# EAGLE design obc_PQ60 (EAGLE 7.3.0)
OBC with integrated microcontroller
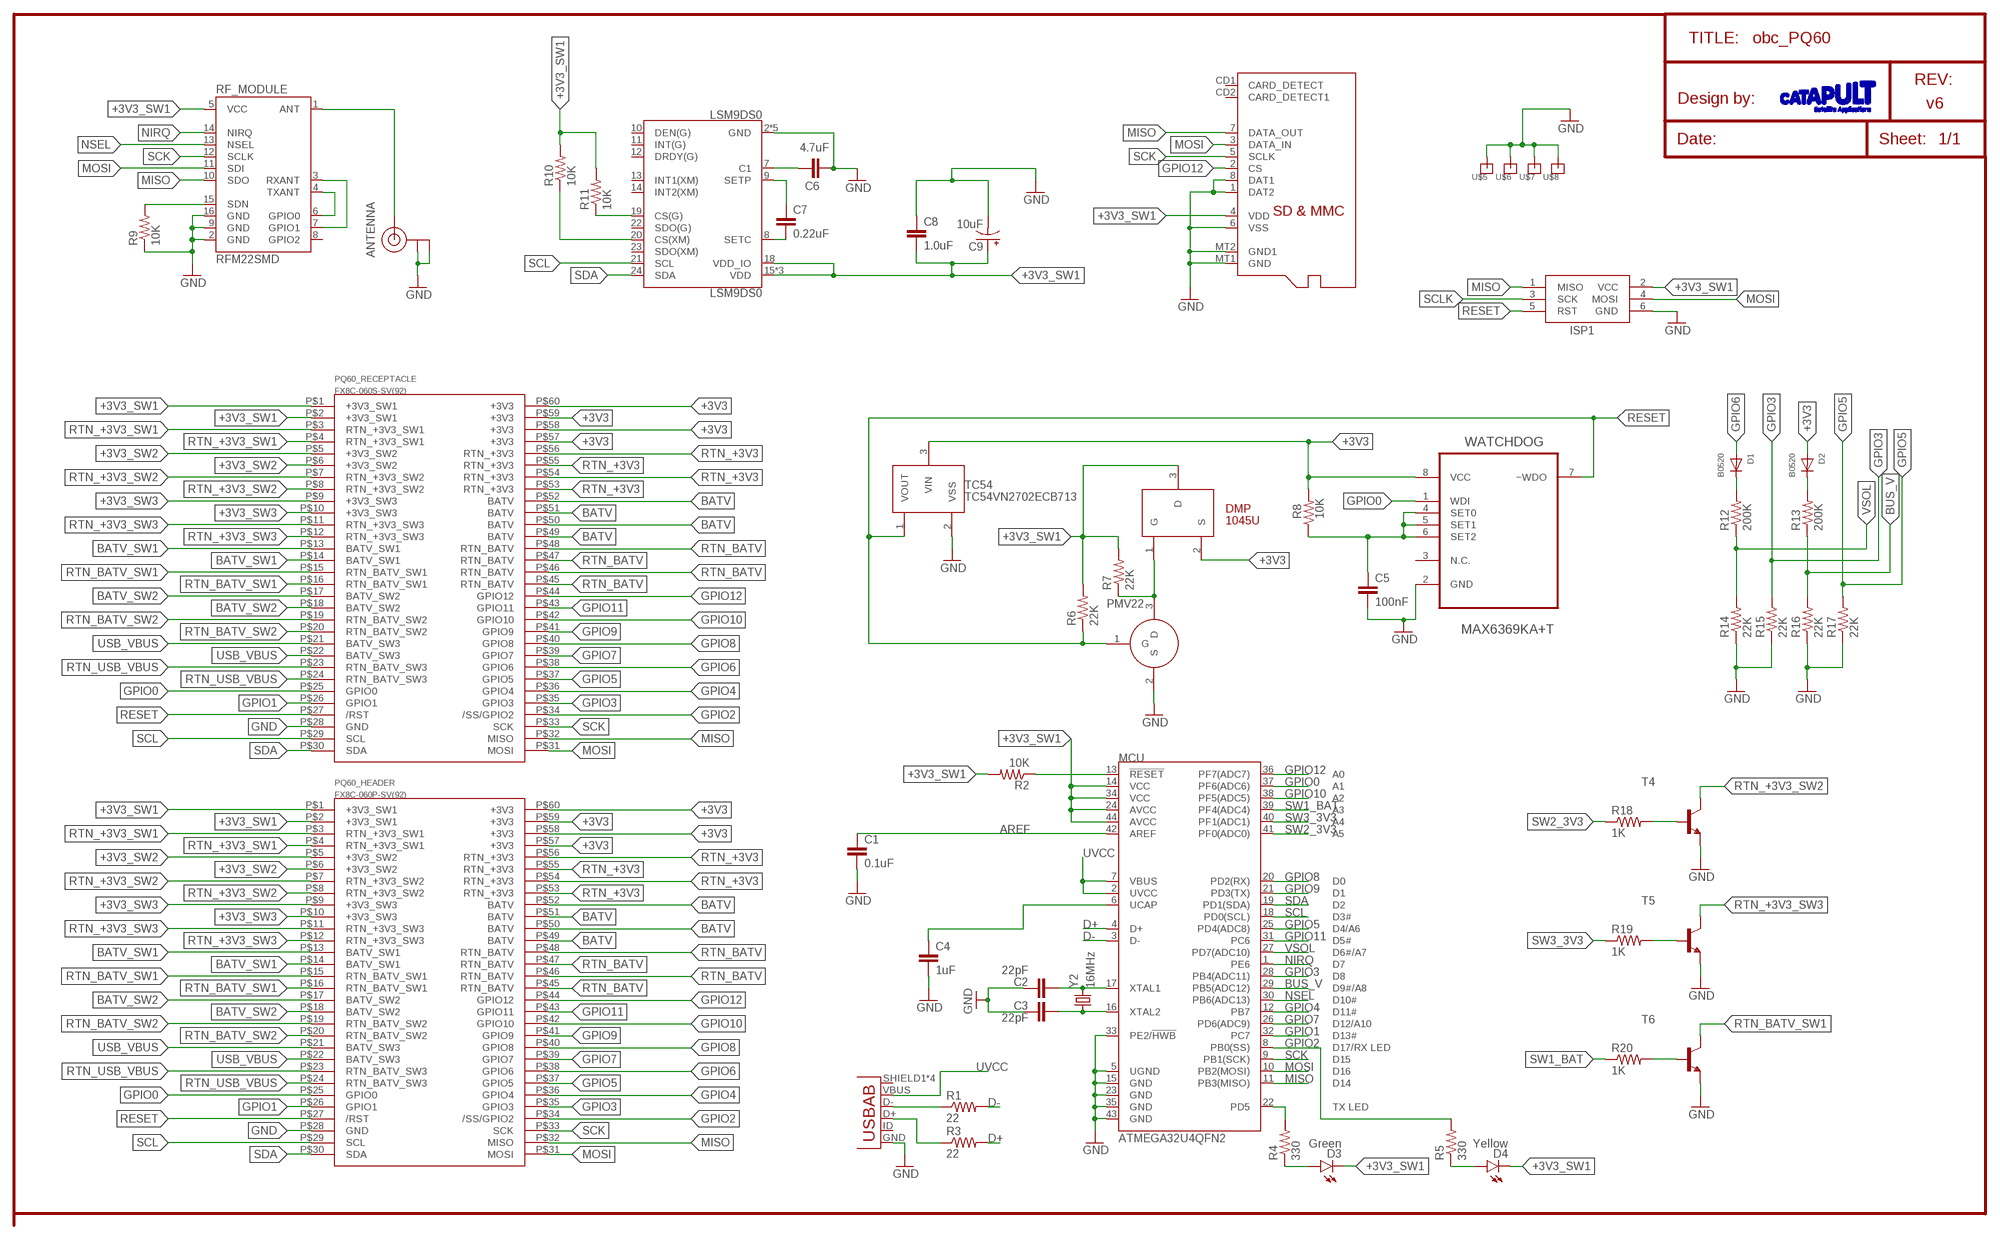
[diagram p0: schematic, sheet 1]

## Parts
ANTENNA  U.FL  [U.FL]
C1  0.1uF  CAP0603-CAP  [0603-CAP]
C2  22pF  CAP0603-CAP  [0603-CAP]
C3  22pF  CAP0603-CAP  [0603-CAP]
C4  1uF  CAP0603-CAP  [0603-CAP]
C5  100nF  CAP0402-CAP  [0402-CAP]
C6  4.7uF  CAP0402-CAP  [0402-CAP]
C7  0.22uF  CAP0402-CAP  [0402-CAP]
C8  1.0uF  CAP0402-CAP  [0402-CAP]
C9  10uF  CAP_POL1206  [EIA3216]
D1  B0520  DIODESOD-123  [SOD-123]
D2  B0520  DIODESOD-123  [SOD-123]
D3  Green  LED0603  [LED-0603]
D4  Yellow  LED0603  [LED-0603]
DMP  1045U  DMP1045USMD  [SOT-23_DMP]
ISP1  AVRISP-6  [AVRISP]
JP1  USB-AB  [USB-AB-MICRO-SMD]
LSM9DS0  LSM9DS0  [LGA-24]
MCU  ATMEGA32U4QFN2  [QFN-44-NOPAD]
PMV22  PMV22SMD  [SOT-23]
PQ60_HEADER  FX8C-060P-SV(92)  [FX8C-060P-SV(92)]
PQ60_RECEPTACLE  FX8C-060S-SV(92)  [FX8C-060S-SV(92)]
R1  22  RESISTOR0603-RES  [0603-RES]
R2  10K  RESISTOR0603-RES  [0603-RES]
R3  22  RESISTOR0603-RES  [0603-RES]
R4  330  RESISTOR0603-RES  [0603-RES]
R5  330  RESISTOR0603-RES  [0603-RES]
R6  22K  RESISTOR0402-RES  [0402-RES]
R7  22K  RESISTOR0402-RES  [0402-RES]
R8  10K  RESISTOR0402-RES  [0402-RES]
R9  10K  RESISTOR0402-RES  [0402-RES]
R10  10K  RESISTOR0402-RES  [0402-RES]
R11  10K  RESISTOR0402-RES  [0402-RES]
R12  200K  RESISTOR0402-RES  [0402-RES]
R13  200K  RESISTOR0402-RES  [0402-RES]
R14  22K  RESISTOR0402-RES  [0402-RES]
R15  22K  RESISTOR0402-RES  [0402-RES]
R16  22K  RESISTOR0402-RES  [0402-RES]
R17  22K  RESISTOR0402-RES  [0402-RES]
R18  1K  RESISTOR0402-RES  [0402-RES]
R19  1K  RESISTOR0402-RES  [0402-RES]
R20  1K  RESISTOR0402-RES  [0402-RES]
RF_MODULE  RFM22SMD  [RFM22-XXX-S2]
SD  MICROSD  [MICROSD]
T4  BC817-16-NPN-SOT23-BEC  [SOT23-BEC]
T5  BC817-16-NPN-SOT23-BEC  [SOT23-BEC]
T6  BC817-16-NPN-SOT23-BEC  [SOT23-BEC]
TC54  TC54VN2702ECB713  [SOT-23A]
U$5  3MMPILAR  [3MMPILAR]
U$6  3MMPILAR  [3MMPILAR]
U$7  3MMPILAR  [3MMPILAR]
U$8  3MMPILAR  [3MMPILAR]
WATCHDOG  MAX6369KA+T  [SOT65P280X145-8N]
Y2  16MHz  CRYSTAL5X3  [CRYSTAL-SMD-5X3]

## Nets
+3V3: D2.A DMP.2(S) PQ60_HEADER.P$57(+3V3) PQ60_HEADER.P$58(+3V3) PQ60_HEADER.P$59(+3V3) PQ60_HEADER.P$60(+3V3) PQ60_RECEPTACLE.P$57(+3V3) PQ60_RECEPTACLE.P$58(+3V3) PQ60_RECEPTACLE.P$59(+3V3) PQ60_RECEPTACLE.P$60(+3V3) R8.2 TC54.3(VIN) WATCHDOG.8(VCC)
+3V3_SW1: C8.2 C9.A(+) D3.C D4.C DMP.3(D) ISP1.2(VCC) LSM9DS0.15(VDD) LSM9DS0.16(VDD) LSM9DS0.17(VDD) LSM9DS0.18(VDD_IO) MCU.14(VCC) MCU.24(AVCC) MCU.34(VCC) MCU.44(AVCC) PQ60_HEADER.P$1(+3V3_SW1) PQ60_HEADER.P$2(+3V3_SW1) PQ60_RECEPTACLE.P$1(+3V3_SW1) PQ60_RECEPTACLE.P$2(+3V3_SW1) R2.2 R6.2 R7.2 R10.2 R11.2 RF_MODULE.5(VCC) SD.4(VDD)
+3V3_SW2: PQ60_HEADER.P$5(+3V3_SW2) PQ60_HEADER.P$6(+3V3_SW2) PQ60_RECEPTACLE.P$5(+3V3_SW2) PQ60_RECEPTACLE.P$6(+3V3_SW2)
+3V3_SW3: PQ60_HEADER.P$9(+3V3_SW3) PQ60_HEADER.P$10(+3V3_SW3) PQ60_RECEPTACLE.P$9(+3V3_SW3) PQ60_RECEPTACLE.P$10(+3V3_SW3)
AREF: C1.1 MCU.42(AREF)
BATV: PQ60_HEADER.P$49(BATV) PQ60_HEADER.P$50(BATV) PQ60_HEADER.P$51(BATV) PQ60_HEADER.P$52(BATV) PQ60_RECEPTACLE.P$49(BATV) PQ60_RECEPTACLE.P$50(BATV) PQ60_RECEPTACLE.P$51(BATV) PQ60_RECEPTACLE.P$52(BATV)
BATV_SW1: PQ60_HEADER.P$13(BATV_SW1) PQ60_HEADER.P$14(BATV_SW1) PQ60_RECEPTACLE.P$13(BATV_SW1) PQ60_RECEPTACLE.P$14(BATV_SW1)
BATV_SW2: PQ60_HEADER.P$17(BATV_SW2) PQ60_HEADER.P$18(BATV_SW2) PQ60_RECEPTACLE.P$17(BATV_SW2) PQ60_RECEPTACLE.P$18(BATV_SW2)
BUS_V: MCU.29(PB5(ADC12)) R13.1 R16.2
D+: MCU.4(D+) R3.2
D-: MCU.3(D-) R1.2
GND: ANTENNA.P$1(GND) ANTENNA.P$2(GND) C1.2 C2.1 C3.1 C4.2 C5.2 C6.1 C8.1 C9.C(-) ISP1.6(GND) JP1.GND LSM9DS0.2(GND) LSM9DS0.3(GND) LSM9DS0.4(GND) LSM9DS0.5(GND) LSM9DS0.6(GND) MCU.5(UGND) MCU.15(GND) MCU.23(GND) MCU.33(PE2/!HWB) MCU.35(GND) MCU.43(GND) PMV22.2(S) PQ60_HEADER.P$28(GND) PQ60_RECEPTACLE.P$28(GND) R9.1 R14.1 R15.1 R16.1 R17.1 RF_MODULE.2(GND) RF_MODULE.9(GND) RF_MODULE.16(GND) SD.1(DAT2) SD.6(VSS) SD.8(DAT1) SD.MT1(GND) SD.MT2(GND1) T4.E T5.E T6.E TC54.2(VSS) U$5.P$1 U$6.P$1 U$7.P$1 U$8.P$1 WATCHDOG.2(GND)
GPIO0: MCU.37(PF6(ADC6)) PQ60_HEADER.P$25(GPIO0) PQ60_RECEPTACLE.P$25(GPIO0) WATCHDOG.1(WDI)
GPIO1: MCU.32(PC7) PQ60_HEADER.P$26(GPIO1) PQ60_RECEPTACLE.P$26(GPIO1)
GPIO2: MCU.8(PB0(SS)) PQ60_HEADER.P$34(/SS/GPIO2) PQ60_RECEPTACLE.P$34(/SS/GPIO2) R5.2
GPIO3: MCU.28(PB4(ADC11)) PQ60_HEADER.P$35(GPIO3) PQ60_RECEPTACLE.P$35(GPIO3) R15.2
GPIO4: MCU.12(PB7) PQ60_HEADER.P$36(GPIO4) PQ60_RECEPTACLE.P$36(GPIO4)
GPIO5: MCU.25(PD4(ADC8)) PQ60_HEADER.P$37(GPIO5) PQ60_RECEPTACLE.P$37(GPIO5) R17.2
GPIO6: D1.A PQ60_HEADER.P$38(GPIO6) PQ60_RECEPTACLE.P$38(GPIO6)
GPIO7: MCU.26(PD6(ADC9)) PQ60_HEADER.P$39(GPIO7) PQ60_RECEPTACLE.P$39(GPIO7)
GPIO8: MCU.20(PD2(RX)) PQ60_HEADER.P$40(GPIO8) PQ60_RECEPTACLE.P$40(GPIO8)
GPIO9: MCU.21(PD3(TX)) PQ60_HEADER.P$41(GPIO9) PQ60_RECEPTACLE.P$41(GPIO9)
GPIO10: MCU.38(PF5(ADC5)) PQ60_HEADER.P$42(GPIO10) PQ60_RECEPTACLE.P$42(GPIO10)
GPIO11: MCU.31(PC6) PQ60_HEADER.P$43(GPIO11) PQ60_RECEPTACLE.P$43(GPIO11)
GPIO12: MCU.36(PF7(ADC7)) PQ60_HEADER.P$44(GPIO12) PQ60_RECEPTACLE.P$44(GPIO12) SD.2(CS)
MISO: ISP1.1(MISO) MCU.11(PB3(MISO)) PQ60_HEADER.P$32(MISO) PQ60_RECEPTACLE.P$32(MISO) RF_MODULE.10(SDO) SD.7(DATA_OUT)
MOSI: ISP1.4(MOSI) MCU.10(PB2(MOSI)) PQ60_HEADER.P$31(MOSI) PQ60_RECEPTACLE.P$31(MOSI) RF_MODULE.11(SDI) SD.3(DATA_IN)
N$1: MCU.13(!RESET) R2.1
N$2: C4.1 MCU.6(UCAP)
N$3: C3.2 MCU.16(XTAL2) Y2.1
N$4: C2.2 MCU.17(XTAL1) Y2.3
N$5: JP1.D+ R3.1
N$6: JP1.D- R1.1
N$7: MCU.22(PD5) R4.2
N$8: DMP.1(G) PMV22.3(D) R7.1
N$9: D4.A R5.1
N$10: D3.A R4.1
N$11: C5.1 R8.1 WATCHDOG.4(SET0) WATCHDOG.5(SET1) WATCHDOG.6(SET2)
N$12: RF_MODULE.4(TXANT) RF_MODULE.6(GPIO0)
N$13: RF_MODULE.3(RXANT) RF_MODULE.7(GPIO1)
N$14: ANTENNA.P$3(SIGNAL) RF_MODULE.1(ANT)
N$15: C6.2 LSM9DS0.7(C1)
N$16: R9.2 RF_MODULE.15(SDN)
N$17: D1.C R12.2
N$18: LSM9DS0.19(CS(G)) R11.1
N$19: LSM9DS0.20(CS(XM)) R10.1
N$20: C7.1 LSM9DS0.9(SETP)
N$21: C7.2 LSM9DS0.8(SETC)
N$22: R18.2 T4.B
N$23: R19.2 T5.B
N$24: R20.2 T6.B
N$26: D2.C R13.2
NIRQ: MCU.1(PE6) RF_MODULE.14(NIRQ)
NSEL: MCU.30(PB6(ADC13)) RF_MODULE.13(NSEL)
RESET: ISP1.5(RST) PMV22.1(G) PQ60_HEADER.P$27(/RST) PQ60_RECEPTACLE.P$27(/RST) R6.1 TC54.1(VOUT) WATCHDOG.7(~WDO)
RTN_+3V3: PQ60_HEADER.P$53(RTN_+3V3) PQ60_HEADER.P$54(RTN_+3V3) PQ60_HEADER.P$55(RTN_+3V3) PQ60_HEADER.P$56(RTN_+3V3) PQ60_RECEPTACLE.P$53(RTN_+3V3) PQ60_RECEPTACLE.P$54(RTN_+3V3) PQ60_RECEPTACLE.P$55(RTN_+3V3) PQ60_RECEPTACLE.P$56(RTN_+3V3)
RTN_+3V3_SW1: PQ60_HEADER.P$3(RTN_+3V3_SW1) PQ60_HEADER.P$4(RTN_+3V3_SW1) PQ60_RECEPTACLE.P$3(RTN_+3V3_SW1) PQ60_RECEPTACLE.P$4(RTN_+3V3_SW1)
RTN_+3V3_SW2: PQ60_HEADER.P$7(RTN_+3V3_SW2) PQ60_HEADER.P$8(RTN_+3V3_SW2) PQ60_RECEPTACLE.P$7(RTN_+3V3_SW2) PQ60_RECEPTACLE.P$8(RTN_+3V3_SW2) T4.C
RTN_+3V3_SW3: PQ60_HEADER.P$11(RTN_+3V3_SW3) PQ60_HEADER.P$12(RTN_+3V3_SW3) PQ60_RECEPTACLE.P$11(RTN_+3V3_SW3) PQ60_RECEPTACLE.P$12(RTN_+3V3_SW3) T5.C
RTN_BATV: PQ60_HEADER.P$45(RTN_BATV) PQ60_HEADER.P$46(RTN_BATV) PQ60_HEADER.P$47(RTN_BATV) PQ60_HEADER.P$48(RTN_BATV) PQ60_RECEPTACLE.P$45(RTN_BATV) PQ60_RECEPTACLE.P$46(RTN_BATV) PQ60_RECEPTACLE.P$47(RTN_BATV) PQ60_RECEPTACLE.P$48(RTN_BATV)
RTN_BATV_SW1: PQ60_HEADER.P$15(RTN_BATV_SW1) PQ60_HEADER.P$16(RTN_BATV_SW1) PQ60_RECEPTACLE.P$15(RTN_BATV_SW1) PQ60_RECEPTACLE.P$16(RTN_BATV_SW1) T6.C
RTN_BATV_SW2: PQ60_HEADER.P$19(RTN_BATV_SW2) PQ60_HEADER.P$20(RTN_BATV_SW2) PQ60_RECEPTACLE.P$19(RTN_BATV_SW2) PQ60_RECEPTACLE.P$20(RTN_BATV_SW2)
RTN_USB_VBUS: PQ60_HEADER.P$23(RTN_BATV_SW3) PQ60_HEADER.P$24(RTN_BATV_SW3) PQ60_RECEPTACLE.P$23(RTN_BATV_SW3) PQ60_RECEPTACLE.P$24(RTN_BATV_SW3)
SCK: MCU.9(PB1(SCK)) PQ60_HEADER.P$33(SCK) PQ60_RECEPTACLE.P$33(SCK) RF_MODULE.12(SCLK) SD.5(SCLK)
SCL: LSM9DS0.21(SCL) MCU.18(PD0(SCL)) PQ60_HEADER.P$29(SCL) PQ60_RECEPTACLE.P$29(SCL)
SCLK: ISP1.3(SCK)
SDA: LSM9DS0.24(SDA) MCU.19(PD1(SDA)) PQ60_HEADER.P$30(SDA) PQ60_RECEPTACLE.P$30(SDA)
SW1_BAT: MCU.39(PF4(ADC4)) R20.1
SW2_3V3: MCU.41(PF0(ADC0)) R18.1
SW3_3V3: MCU.40(PF1(ADC1)) R19.1
USB_VBUS: PQ60_HEADER.P$21(BATV_SW3) PQ60_HEADER.P$22(BATV_SW3) PQ60_RECEPTACLE.P$21(BATV_SW3) PQ60_RECEPTACLE.P$22(BATV_SW3)
UVCC: JP1.VBUS MCU.2(UVCC) MCU.7(VBUS)
VSOL: MCU.27(PD7(ADC10)) R12.1 R14.2
Unconnected: JP1.ID(USBID) JP1.SHIELD1(SHIELD) JP1.SHIELD2(SHIELD) JP1.SHIELD3(SHIELD) JP1.SHIELD4(SHIELD) LSM9DS0.10(DEN(G)) LSM9DS0.11(INT(G)) LSM9DS0.12(DRDY(G)) LSM9DS0.13(INT1(XM)) LSM9DS0.14(INT2(XM)) LSM9DS0.22(SDO(G)) LSM9DS0.23(SDO(XM)) RF_MODULE.8(GPIO2) SD.CD1(CARD_DETECT) SD.CD2(CARD_DETECT1) WATCHDOG.3(N.C.)

## Notes on the sheet
- TITLE:
- REV:
- Design by:
- v6
- Date: | Sheet:

## Library data of the parts
ANTENNA = SparkFun-Connectors:U.FL: SMD antenna connector- WRL-09144; PROD_ID: CONN-09193
C1-C8 = SparkFun-Capacitors:CAP: Capacitor Standard 0603 ceramic capacitor, and 0.1" leaded capacitor.
C9 = SparkFun-Capacitors:CAP_POL: Capacitor Polarized These are standard SMD and PTH capacitors. Normally 10uF, 47uF, and 100uF in electrolytic and tantalum varieties. Always verify the external diameter of the through hole cap, it varies with capacity, voltage, and manufacturer. The EIA devices should be standard.
D1 D2 = adafruit:DIODE: Diode SMADIODE - SMA Surface Mount Package 20V 1A Schottky Diode Digikey: 641-1014-6-ND DO-1N4148 - Through Hole Small Current Diode SOD-123 20V 1 A (.5mV Vf) Schottky Diode - Digikey: MBRX120TPMSCT-ND SOD-323 10V 570mA (.38mV Vf, 3ns) Schottky Diode - Digikey: ZLLS410CT-ND SOD-523 30V 30mA Schottky Diode (RB751S-40TE61) - Digikey: RB751S-40TE61CT-ND SOT23-R/W - SOT23 Package (R = Solder Paste/Reflow Ovens, W = Hand-Soldering) BAT54Film 40V 300mA - Digikey: 497-7162-1-ND
D3 D4 = SparkFun-LED:LED: LEDs Standard schematic elements and footprints for 5mm, 3mm, 1206, and 0603 sized LEDs. 5mm - Spark Fun Electronics SKU : COM-00529 (and others)
DMP = OBC:DMP1045U: P-CHANNEL ENHANCEMENT MODE MOSFET
ISP1 = adafruit:AVRISP: AVR ISP HEADER Standard 6 pin header for AVR programming
JP1 = SparkFun-Connectors:USB-AB: This is a USB AB connector that is compatible with USB OTG. i.e. this connector can serve as a host or device
LSM9DS0 = SparkFun-DigitalIC:LSM9DS0: LSM9DS0 3D Accelerometer, 3D Gyroscope, 3D Magnetomter Features: 3 acceleration channels, 3 angular rate channels, 3 magnetic field channels ±2/±4/±6/±8/±16 g linear acceleration full scale ±2/±4/±8/±12 gauss magnetic full scale ±245/±500/±2000 dps angular rate full scale 16-bit data output SPI / I2C serial interfaces Analog supply voltage 2.4 V to 3.6 V Power-down mode / low-power mode Programmable interrupt generators Embedded self-test Embedded temperature sensor Embedded FIFO Position and motion detection functions Click/double-click recognition
MCU = SparkFun-DigitalIC:ATMEGA32U4: Atmel 44-pin 8-bit Microcontroller with 32KBytes of ISP Flash and USB Controller
PMV22 = OBC:PMV22
PQ60_HEADER = Template:FX8C-060P-SV(92)
PQ60_RECEPTACLE = Template:FX8C-060S-SV(92)
R1-R20 = SparkFun-Passives:RESISTOR: Resistor Basic schematic elements and footprints for 0603, 1206, and PTH resistors.
RF_MODULE = SparkFun-RF:RFM22: The RFM22 is a low-power, low cost radio that is capable of operating in the 434MHz and 900MHz open bands. It's frequency is software defined and there are some very good libraries written for it.
SD = adafruit:MICROSD: Micro-SD / Transflash card holder with SPI pinout For the 3M # 2908-05WB-MG and/or 4UCON #19656 push-push type
T4-T6 = transistor:*-NPN-: NPN Transistror BF959 corrected 2008.03.06
TC54 = OBC:TC54: VOLTAGE DETECTOR, 3.6UA, 10V, SMD-3
U$5-U$8 = LMA:3MMPILAR
WATCHDOG = Maxim_By_element14_Batch_1:MAX6369KA+T: Pin-Selectable Watchdog Timers; MPN: MAX6369KA+T; OC_FARNELL: 1787051; OC_NEWARK: 68K9450; PACKAGE: SOT23-8; SUPPLIER: Maxim
Y2 = SparkFun-FreqCtrl:CRYSTAL: Various standard crystals. Proven footprints.; PROD_ID: XTAL-08218

## Board
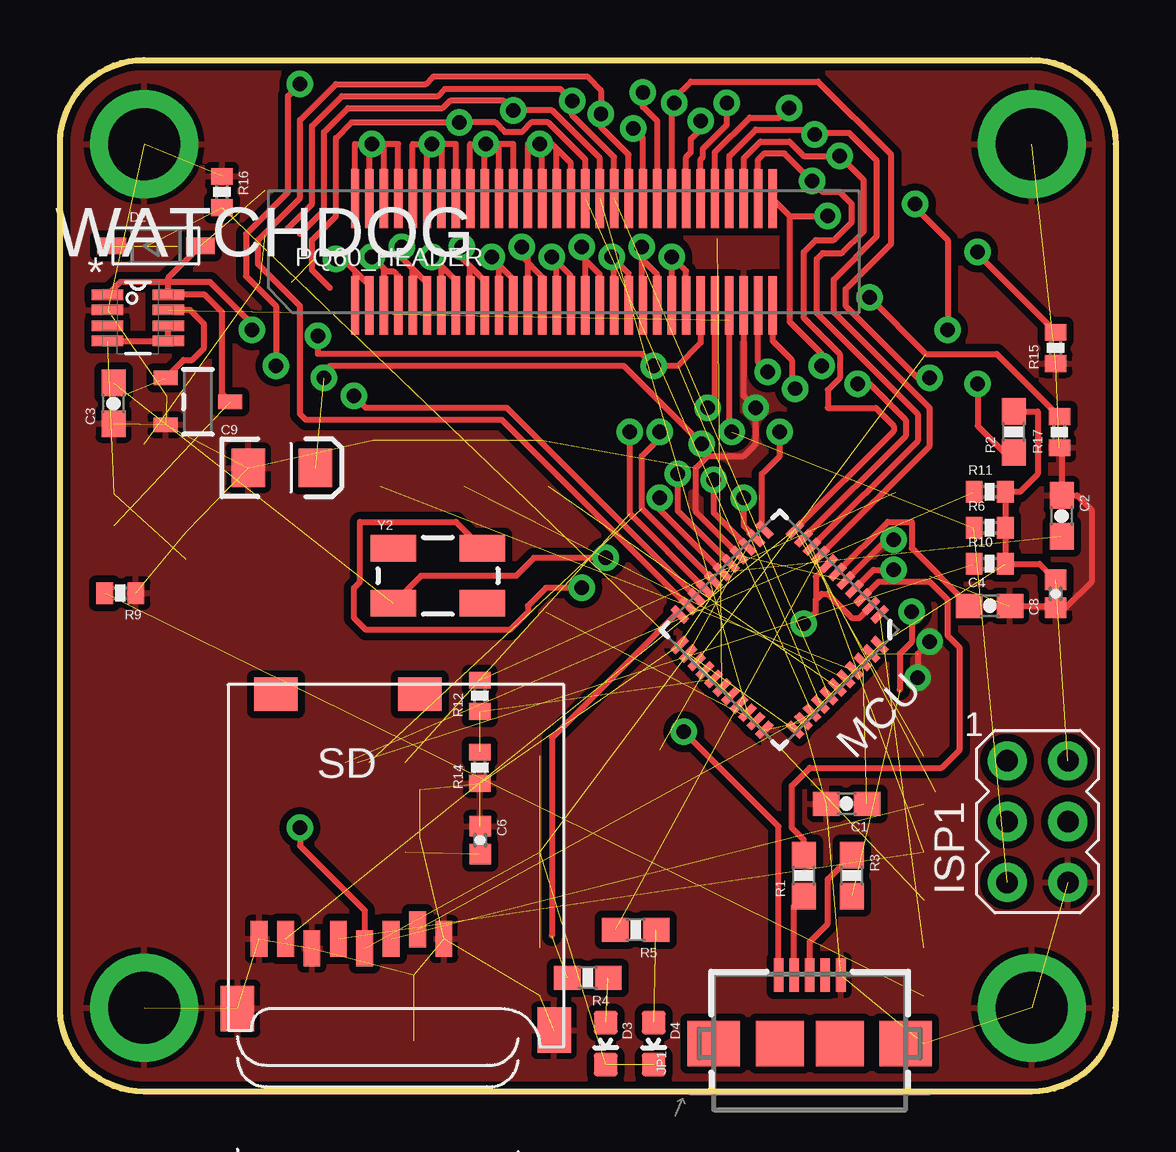
[diagram p1: board, top side]
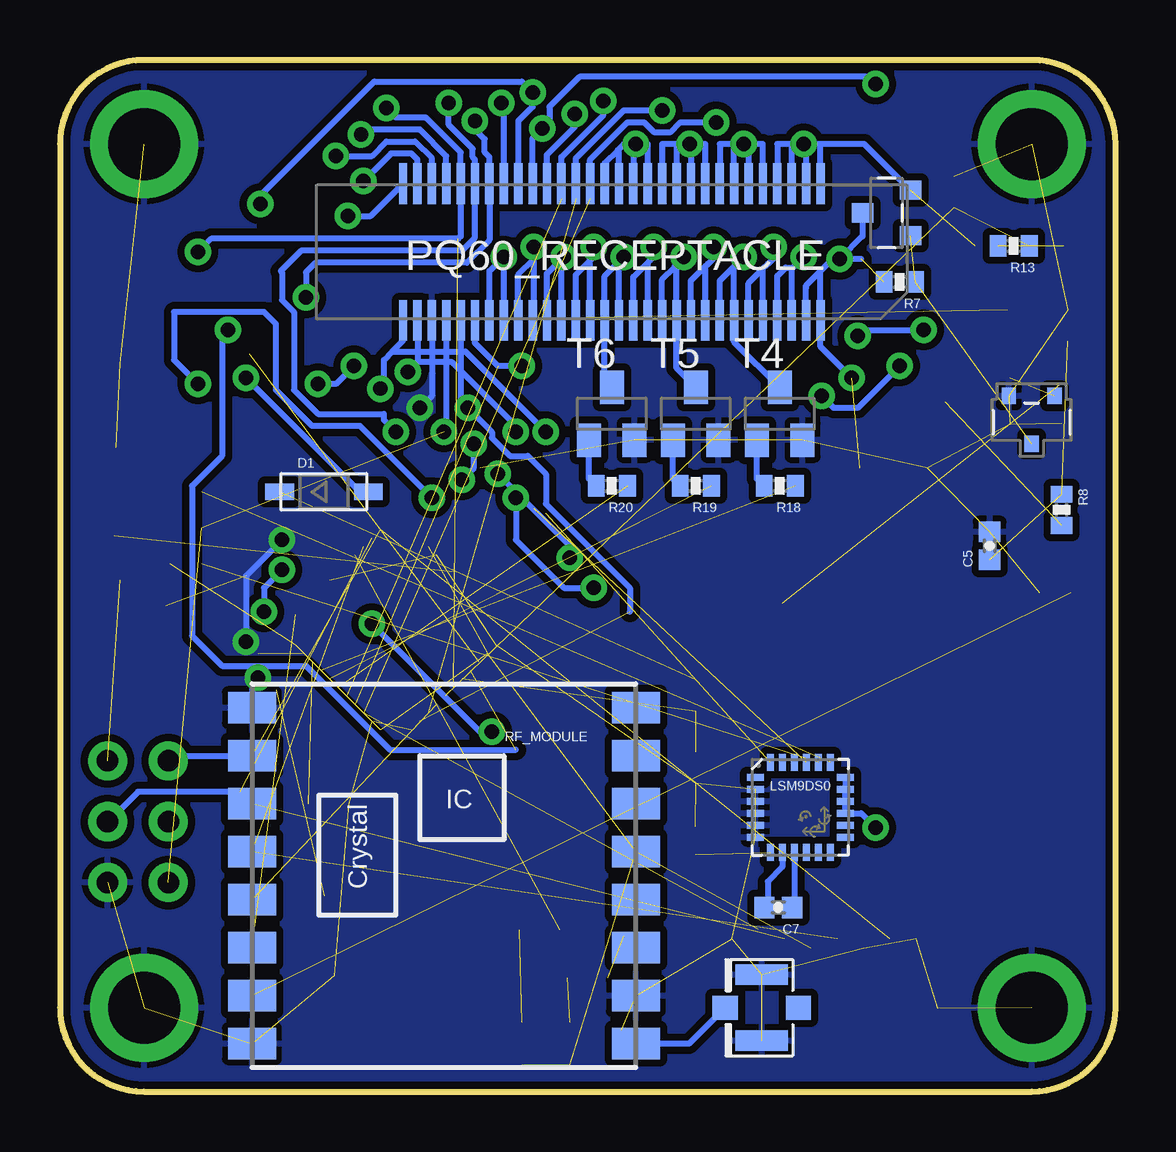
[diagram p2: board, bottom side, seen from below]

Size 44 x 43 mm. Coordinates in mm from the lower left corner, seen from the top.
Outline: 0,3.5 0,39.5 arc-90 3.5,43 40.5,43 arc-90 44,39.5 44,3.5 arc-90 40.5,0 3.5,0 arc-90 0,3.5
Copper layers (1*16): Top 0.035mm / dielectric 1.5mm / Bottom 0.035mm
Design rules "pcbtrain *": minimum track width 0.2mm, minimum drill 0.4mm, track to track 0.2mm, track to pad 0.2mm, pad to pad 0.2mm, via to via 0.2mm, smd to smd 0mil, copper to edge 10mil, drill to drill 0.2mm, minimum pad ring 10mil, minimum via ring 10mil, stop-mask expansion 0.125mm, vias tented up to drill 25mil, thermal gap 10mil

### Footprints (pad centres in the part's own frame; a part is rotated, then mirrored left to right if it is on the bottom)
U.FL = smd 2.2 x 0.85: P$1 0,1.375; P$2 0,-1.375 | smd 1.05 x 1: P$3 1.525,0; P$4 -1.525,0
0603-CAP = smd 1.1 x 1: 1 -0.85,0; 2 0.85,0
0402-CAP = smd 0.85 x 0.9: 1 -0.58,0; 2 0.58,0
EIA3216 = smd 1.4 x 1.6: A 1.4,0; C -1.4,0
SOD-123 = smd 1.2 x 0.7: A 1.85,0; C -1.85,0
LED-0603 = smd 1 x 1: A 0,-0.877; C 0,0.877
SOT-23_DMP = smd 0.8 x 0.9: 1 -0.95,-1; 2 0.95,-1; 3 0,1
AVRISP = drill 0.9 pad 1.626: 1 -1.27,2.54; 2 1.27,2.54; 3 -1.27,0; 4 1.27,0; 5 -1.27,-2.54; 6 1.27,-2.54
USB-AB-MICRO-SMD = smd 1.4 x 0.4: D+ 2.85,0; D- 2.85,0.65; GND 2.85,-1.3; ID 2.85,-0.65; VBUS 2.85,1.3 | smd 1.9 x 2.2: SHIELD1 0,4; SHIELD4 0,-4 | smd 1.9 x 2: SHIELD2 0,1.25; SHIELD3 0,-1.25
LGA-24 = smd 0.7 x 0.29: 1 -1.875,1.25; 2 -1.875,0.75; 3 -1.875,0.25; 4 -1.875,-0.25; 5 -1.875,-0.75; 6 -1.875,-1.25; 13 1.875,-1.25; 14 1.875,-0.75; 15 1.875,-0.25; 16 1.875,0.25; 17 1.875,0.75; 18 1.875,1.25 | smd 0.29 x 0.7: 7 -1.25,-1.875; 8 -0.75,-1.875; 9 -0.25,-1.875; 10 0.25,-1.875; 11 0.75,-1.875; 12 1.25,-1.875; 19 1.25,1.875; 20 0.75,1.875; 21 0.25,1.875; 22 -0.25,1.875; 23 -0.75,1.875; 24 -1.25,1.875
QFN-44-NOPAD = smd 0.8 x 0.3: 1 -3.4,2.5; 2 -3.4,2; 3 -3.4,1.5; 4 -3.4,1; 5 -3.4,0.5; 6 -3.4,0; 7 -3.4,-0.5; 8 -3.4,-1; 9 -3.4,-1.5; 10 -3.4,-2; 11 -3.4,-2.5; 23 3.4,-2.5; 24 3.4,-2; 25 3.4,-1.5; 26 3.4,-1; 27 3.4,-0.5; 28 3.4,0; 29 3.4,0.5; 30 3.4,1; 31 3.4,1.5; 32 3.4,2; 33 3.4,2.5 | smd 0.3 x 0.8: 12 -2.5,-3.4; 13 -2,-3.4; 14 -1.5,-3.4; 15 -1,-3.4; 16 -0.5,-3.4; 17 0,-3.4; 18 0.5,-3.4; 19 1,-3.4; 20 1.5,-3.4; 21 2,-3.4; 22 2.5,-3.4; 34 2.5,3.4; 35 2,3.4; 36 1.5,3.4; 37 1,3.4; 38 0.5,3.4; 39 0,3.4; 40 -0.5,3.4; 41 -1,3.4; 42 -1.5,3.4; 43 -2,3.4; 44 -2.5,3.4
SOT-23 = smd 0.6 x 0.7: 1 0.95,1; 2 -0.95,1; 3 0,-1
FX8C-060P-SV(92) = smd 0.35 x 2.45: P$1 -8.7,-2.225; P$2 -8.1,-2.225; P$3 -7.5,-2.225; P$4 -6.9,-2.225; P$5 -6.3,-2.225; P$6 -5.7,-2.225; P$7 -5.1,-2.225; P$8 -4.5,-2.225; P$9 -3.9,-2.225; P$10 -3.3,-2.225; P$11 -2.7,-2.225; P$12 -2.1,-2.225; P$13 -1.5,-2.225; P$14 -0.9,-2.225; P$15 -0.3,-2.225; P$16 0.3,-2.225; P$17 0.9,-2.225; P$18 1.5,-2.225; P$19 2.1,-2.225; P$20 2.7,-2.225; P$21 3.3,-2.225; P$22 3.9,-2.225; P$23 4.5,-2.225; P$24 5.1,-2.225; P$25 5.7,-2.225; P$26 6.3,-2.225; P$27 6.9,-2.225; P$28 7.5,-2.225; P$29 8.1,-2.225; P$30 8.7,-2.225; P$31 8.7,2.225; P$32 8.1,2.225; P$33 7.5,2.225; P$34 6.9,2.225; P$35 6.3,2.225; P$36 5.7,2.225; P$37 5.1,2.225; P$38 4.5,2.225; P$39 3.9,2.225; P$40 3.3,2.225; P$41 2.7,2.225; P$42 2.1,2.225; P$43 1.5,2.225; P$44 0.9,2.225; P$45 0.3,2.225; P$46 -0.3,2.225; P$47 -0.9,2.225; P$48 -1.5,2.225; P$49 -2.1,2.225; P$50 -2.7,2.225; P$51 -3.3,2.225; P$52 -3.9,2.225; P$53 -4.5,2.225; P$54 -5.1,2.225; P$55 -5.7,2.225; P$56 -6.3,2.225; P$57 -6.9,2.225; P$58 -7.5,2.225; P$59 -8.1,2.225; P$60 -8.7,2.225
FX8C-060S-SV(92) = smd 0.35 x 1.7: P$1 -8.7,2.85; P$2 -8.1,2.85; P$3 -7.5,2.85; P$4 -6.9,2.85; P$5 -6.3,2.85; P$6 -5.7,2.85; P$7 -5.1,2.85; P$8 -4.5,2.85; P$9 -3.9,2.85; P$10 -3.3,2.85; P$11 -2.7,2.85; P$12 -2.1,2.85; P$13 -1.5,2.85; P$14 -0.9,2.85; P$15 -0.3,2.85; P$16 0.3,2.85; P$17 0.9,2.85; P$18 1.5,2.85; P$19 2.1,2.85; P$20 2.7,2.85; P$21 3.3,2.85; P$22 3.9,2.85; P$23 4.5,2.85; P$24 5.1,2.85; P$25 5.7,2.85; P$26 6.3,2.85; P$27 6.9,2.85; P$28 7.5,2.85; P$29 8.1,2.85; P$30 8.7,2.85; P$31 8.7,-2.85; P$32 8.1,-2.85; P$33 7.5,-2.85; P$34 6.9,-2.85; P$35 6.3,-2.85; P$36 5.7,-2.85; P$37 5.1,-2.85; P$38 4.5,-2.85; P$39 3.9,-2.85; P$40 3.3,-2.85; P$41 2.7,-2.85; P$42 2.1,-2.85; P$43 1.5,-2.85; P$44 0.9,-2.85; P$45 0.3,-2.85; P$46 -0.3,-2.85; P$47 -0.9,-2.85; P$48 -1.5,-2.85; P$49 -2.1,-2.85; P$50 -2.7,-2.85; P$51 -3.3,-2.85; P$52 -3.9,-2.85; P$53 -4.5,-2.85; P$54 -5.1,-2.85; P$55 -5.7,-2.85; P$56 -6.3,-2.85; P$57 -6.9,-2.85; P$58 -7.5,-2.85; P$59 -8.1,-2.85; P$60 -8.7,-2.85
0603-RES = smd 1.1 x 1: 1 -0.85,0; 2 0.85,0
0402-RES = smd 0.7 x 0.9: 1 -0.65,0; 2 0.65,0
RFM22-XXX-S2 = smd 2 x 1.3: 1 -8,7; 2 -8,5; 3 -8,3; 4 -8,1; 5 -8,-1; 6 -8,-3; 7 -8,-5; 8 -8,-7; 9 8,-7; 10 8,-5; 11 8,-3; 12 8,-1; 13 8,1; 14 8,3; 15 8,5; 16 8,7
MICROSD = smd 0.7 x 1.5: 1 9,-10.64; 2 7.9,-10.24; 3 6.8,-10.64; 4 5.7,-11.04; 5 4.6,-10.64; 6 3.5,-11.04; 7 2.4,-10.64; 8 1.3,-10.64 | smd 1.8 x 1.4: CD1 2,-0.44; CD2 8,-0.44 | smd 1.4 x 1.9: MT1 0.4,-13.54; MT2 13.6,-14.44
SOT23-BEC = smd 1 x 1.4: B -0.95,-1.1; C 0,1.1; E 0.95,-1.1
SOT-23A = smd 0.6 x 1: 1 -1,-1.35; 2 0.95,-1.35; 3 0,1.35
3MMPILAR = drill 3 pad 4.5: P$1 0,0
SOT65P280X145-8N = smd 1.321 x 0.432: 1 -1.27,0.965; 2 -1.27,0.33; 3 -1.27,-0.33; 4 -1.27,-0.965; 5 1.27,-0.965; 6 1.27,-0.33; 7 1.27,0.33; 8 1.27,0.965
CRYSTAL-SMD-5X3 = smd 1.9 x 1.1: 1 -1.85,-1.15; 2 1.85,-1.15; 3 1.85,1.15; 4 -1.85,1.15

### Placement (x,y rotation side)
ANTENNA  14.75,3.5 180 bottom
C1  32.79,12 180 top
C2  41.75,24 270 top
C3  2.23,28.68 90 top
C4  38.75,20.25 0 top
C5  5.25,22.75 90 bottom
C6  17.52,10.47 270 top
C7  14.05,7.67 180 bottom
C8  41.5,20.75 90 top
C9  9.25,26 0 top
D1  33,25 0 bottom
D2  4,35.25 0 top
D3  22.75,2 180 top
D4  24.75,2 180 top
DMP  9.54,36.62 90 bottom
ISP1  40.75,11.25 0 top
JP1  31.25,2 90 top
LSM9DS0  13.14,11.85 0 bottom
MCU  30,19.25 225 top
PMV22  3.5,28 0 bottom
PQ60_HEADER  21,35 0 top
PQ60_RECEPTACLE  21,35 180 bottom
R1  31,9 90 top
R2  39.75,27.5 90 top
R3  33,9 270 top
R4  22,4.75 180 top
R5  24,6.75 180 top
R6  38.75,23.5 0 top
R7  9,33.75 180 bottom
R8  2.25,24.25 270 bottom
R9  2.52,20.77 180 top
R10  38.75,22 0 top
R11  38.75,25 0 top
R12  17.5,16.5 90 top
R13  4.25,35.25 180 bottom
R14  17.5,13.5 90 top
R15  41.5,31 90 top
R16  6.75,37.5 270 top
R17  41.66,27.48 90 top
R18  14,25.25 180 bottom
R19  17.5,25.25 180 bottom
R20  21,25.25 180 bottom
RF_MODULE  28,9 180 bottom
SD  7,17 0 top
T4  14,28.25 0 bottom
T5  17.5,28.25 0 bottom
T6  21,28.25 0 bottom
TC54  5.75,28.75 270 top
U$1  [PQ60]  55.5,52.5 0 top  (outside the outline)
U$3  [SA_LOGO]  39.5,54.5 0 top  (outside the outline)
U$5  40.5,39.5 0 top
U$6  3.5,39.5 0 top
U$7  40.5,3.5 0 top
U$8  3.5,3.5 0 top
WATCHDOG  3.25,32.25 0 top
Y2  15.75,21.5 0 top

### Tracks (layer width: path | path; a pad name or v marks a point on that pad's centre or on a via)
+3V3  (via drill 0.6)  (2 unrouted)
  Top 0.254: PQ60_HEADER.P$59 12.9,39.5 v13,39.5 | PQ60_HEADER.P$60 12.3,39.5 v13,39.5 | PQ60_HEADER.P$58 13.5,39.5 | 13.5,39.5 v13,39.5 | PQ60_HEADER.P$57 14.1,39.5 13.5,39.5 | TC54.3 6.75,29.1 6.75,32.5 6.04,33.22 WATCHDOG.8 4.52,33.92 D2.A
  Bottom 0.254: PQ60_RECEPTACLE.P$60 12.3,39.5 v13,39.5 | v13,39.5 13.5,39.5 | 13.5,39.5 14.1,39.5 PQ60_RECEPTACLE.P$57 | v13,39.5 arc90 12.9,39.4 PQ60_RECEPTACLE.P$59 | PQ60_RECEPTACLE.P$58 13.5,39.5 | DMP.2 10.47,39.5 v13,39.5
+3V3_SW1  (via drill 0.6)  (11 unrouted)
  Top 0.254: PQ60_HEADER.P$2 12.9,33.6 12.3,34.2 | 12.3,34.2 11.8,34.7 v11.5,34.7 | 12.3,34.2 PQ60_HEADER.P$1 | MCU.14 27.25,24.12 v27.25,25.5 | v26.75,27 23.5,30.25 11.25,30.25 11,30 v11,29.75 | R2.2 40.75,28.35 40.75,25.75 40,25 R11.2 R6.2 R10.2 40.83,22 C8.2 | v10,11 10,10.25 12.7,7.55 SD.4
  Bottom 0.254: 12.9,33.5 PQ60_RECEPTACLE.P$2 12.9,33.6 12.3,34.2 | v11.5,34.7 11.8,34.7 12.3,34.2 | 12.3,34.2 PQ60_RECEPTACLE.P$1 12.3,31.05 v11,29.75 | DMP.3 10.54,35.66 v11.5,34.7 | 10.6,34.7 v11.5,34.7 | v27.25,25.5 26.75,26 v26.75,27 | LSM9DS0.18 LSM9DS0.17 LSM9DS0.16 LSM9DS0.15 10.6,11.6 v10,11
+3V3_SW2  (via drill 0.6)
  Top 0.254: 14.7,34.3 15.3,33.7 PQ60_HEADER.P$6 | v14.25,35.2 14.25,34.75 14.5,34.5 14.7,34.3 | PQ60_HEADER.P$5 14.7,34.3
  Bottom 0.254: PQ60_RECEPTACLE.P$6 15.3,33.7 14.7,34.3 | v14.25,35.2 14.25,34.75 14.5,34.5 14.7,34.3 | PQ60_RECEPTACLE.P$5 14.7,34.3
+3V3_SW3  (via drill 0.6)
  Top 0.254: PQ60_HEADER.P$10 17.7,33.8 17.1,34.4 | v16.75,35.2 16.75,34.75 16.88,34.62 17.1,34.4 | PQ60_HEADER.P$9 17.1,34.4
  Bottom 0.254: PQ60_RECEPTACLE.P$10 17.7,33.8 17.1,34.4 | v16.75,35.2 16.75,34.75 17,34.5 17.1,34.4 | PQ60_RECEPTACLE.P$9 17.1,34.4
AREF  (1 unrouted)
BATV  (via drill 0.6)
  Top 0.254: PQ60_HEADER.P$51 17.7,39.5 v17.75,39.5 | PQ60_HEADER.P$50 18.3,39.5 v17.75,39.5 | PQ60_HEADER.P$49 18.9,39.5 v17.75,39.5 | PQ60_HEADER.P$52 17.1,39.5 v17.75,39.5
  Bottom 0.254: PQ60_RECEPTACLE.P$52 17.1,39.5 v17.75,39.5 | v17.75,39.5 18.9,39.5 PQ60_RECEPTACLE.P$49 | v17.75,39.5 arc90 17.7,39.45 PQ60_RECEPTACLE.P$51 | 18.25,37.9 arc90 PQ60_RECEPTACLE.P$50 18.3,39.5 v17.75,39.5
BATV_SW1  (via drill 0.6)
  Top 0.254: PQ60_HEADER.P$13 19.5,34.95 v19.25,35.2 19.25,34.8 20.1,33.95 PQ60_HEADER.P$14
  Bottom 0.254: PQ60_RECEPTACLE.P$14 20.1,33.95 19.5,34.55 | v19.25,35.2 19.25,34.8 19.4,34.65 19.5,34.55 | PQ60_RECEPTACLE.P$13 19.5,34.55
BATV_SW2  (via drill 0.6)
  Top 0.254: PQ60_HEADER.P$18 22.5,34.05 21.75,34.8 v21.75,35.2 21.9,35.05 PQ60_HEADER.P$17
  Bottom 0.254: PQ60_RECEPTACLE.P$18 22.5,34.05 21.75,34.8 v21.75,35.2 21.9,35.05 PQ60_RECEPTACLE.P$17
BUS_V  (2 unrouted)
D+  (via drill 0.6)  (1 unrouted)
  Top 0.254: MCU.4 33.91,21.75 v34.75,21.75 | v35.5,20 35.5,18.75 35,18.25 35,16.75
  Bottom 0.254: v34.75,21.75 35.5,21 v35.5,20
D-
  Top 0.254: R1.2 31,10.5 30.5,11 30.5,12.75 31.25,13.5 36.75,13.5 37.5,14.25 37.5,18.5 37,19 37,20.5 36.25,21.25 34.12,21.25 MCU.3
GND  (via drill 0.6)  (41 unrouted)
  Top 0.254: PQ60_HEADER.P$28 28.5,29 v29,28.5 29,27 28.5,26.5 27,26.5 26.5,26 26.5,24.16 MCU.15 | R17.1 41.75,26.75 C2.1 42.4,24.85 43,24.25 43,21.25 41.92,20.17 C8.1 41.42,20.25 C4.2 | MCU.5 34.46,23 v34.75,23 | v36.25,18.75 35.75,18.25 v35.75,17.25
  Bottom 0.254: PQ60_RECEPTACLE.P$28 28.5,29 v29,28.5 | v34.75,23 36.25,21.5 v36.25,18.75 | v35.75,17.25 36,17 RF_MODULE.9
  pour Top (isolate 0.3): 0,0 0,43 44,43 44,0
  pour Bottom (isolate 0.3): 0,0 0,43 44,43 44,0
GPIO0  (via drill 0.6)  (1 unrouted)
  Top 0.254: PQ60_HEADER.P$25 26.7,31.2 25.75,30.25 v24.75,30.25 24.25,30.75 10.75,30.75 v10.75,31.5 | v8,31.75 8,32 6.25,33.75 2.52,33.75 WATCHDOG.1
  Bottom 0.254: v24.75,30.25 25.75,30.25 26.7,31.2 PQ60_RECEPTACLE.P$25 | v10.75,31.5 10.5,31.75 v8,31.75
GPIO1  (via drill 0.6)  (1 unrouted)
  Top 0.254: v27,28.5 27.3,28.8 PQ60_HEADER.P$26
  Bottom 0.254: PQ60_RECEPTACLE.P$26 27.3,28.8 v27,28.5 26,27.5 26,27.25 25.25,26.5 24.5,26.5 23.75,25.75 23.75,24.5 20.25,21 20.25,20
GPIO2  (via drill 0.6)  (1 unrouted)
  Top 0.254: PQ60_HEADER.P$34 27.9,39 29,40.1 31.25,40.1 v31.45,39.9 arc-90 31.5,39.95 32.9,39.95 34.05,38.8 34.05,35.65 32.25,33.85 32.25,32.5 36.25,28.5 36.25,26.91 MCU.8
  Bottom 0.254: PQ60_RECEPTACLE.P$34 27.9,39 29,40.1 31.25,40.1 v31.45,39.9
GPIO3  (via drill 0.6)  (1 unrouted)
  Top 0.254: PQ60_HEADER.P$35 27.3,39.15 28.75,40.6 30,40.6 v30.4,41 | v38.25,35 38.25,34.9 R15.2
  Bottom 0.254: v30.4,41 30,40.6 28.75,40.6 27.3,39.15 PQ60_RECEPTACLE.P$35 27.3,35.65 27.4,35.55 37.7,35.55 v38.25,35
GPIO4  (via drill 0.6)
  Top 0.254: v27.8,41.2 27.8,40.3 26.8,39.3 26.8,38.95 26.7,38.85 PQ60_HEADER.P$36 | MCU.12 29.25,23.54 29.25,25.75 30,26.5 v30,27.5
  Bottom 0.254: v27.8,41.2 27.8,40.3 26.8,39.3 26.8,38.95 26.7,38.85 PQ60_RECEPTACLE.P$36 26.7,35.6 27.25,35.05 33.95,35.05 34.8,34.2 34.75,34.15 34.75,33 34.25,32.5 34.25,29.25 33.25,28.25 30.5,28.25 30.5,28 v30,27.5
GPIO5  (via drill 0.6)  (1 unrouted)
  Top 0.254: PQ60_HEADER.P$37 26.1,38.95 26.3,39.15 26.3,39.7 26.7,40.1 v26.7,40.45 | v33.75,33.1 36.1,30.75 39.05,30.75 R17.2
  Bottom 0.254: v26.7,40.45 26.7,40.1 26.3,39.7 26.3,39.15 26.1,38.95 PQ60_RECEPTACLE.P$37 26.1,35.5 27.05,34.55 33.35,34.55 33.75,34.15 v33.75,33.1
GPIO6  (via drill 0.6)
  Top 0.254: PQ60_HEADER.P$38 25.5,41.1 v25.6,41.2 25.6,41.4 26.3,42.1 31.6,42.1 34.65,39.05 34.65,35.35 32.75,33.45 32.75,32.75 35.75,29.75 v36.25,29.75
  Bottom 0.254: PQ60_RECEPTACLE.P$38 25.5,41.1 v25.6,41.2 | v36.25,29.75 31.5,25 D1.A
GPIO7  (via drill 0.6)  (1 unrouted)
  Top 0.254: PQ60_HEADER.P$39 24.9,40.45 24.3,41.05 v24.3,41.65 | v35.65,37 35.65,36.85 37,35.5 v37,31.75
  Bottom 0.254: PQ60_RECEPTACLE.P$39 24.9,40.45 24.3,41.05 v24.3,41.65 24.75,42.1 30.9,42.1 35.65,37.35 v35.65,37 | v37,31.75 37.25,31.5 37.25,26.5 38.5,25.25 38.5,19 37.25,17.75 33.75,17.75 30.25,14.25 25,14.25
GPIO8  (via drill 0.6)
  Top 0.254: PQ60_HEADER.P$40 24.3,39.75 v23.9,40.15 | v10,42 9.5,41.5 9.5,37.5 7.75,35.75 7.75,34 9,32.75 v9,30.25 | MCU.20 18.63,28.5 12.75,28.5 v12.25,29
  Bottom 0.254: PQ60_RECEPTACLE.P$40 24.3,39.75 v23.9,40.15 23.6,40.45 23.6,41.05 22.35,42.3 10.3,42.3 v10,42 | v9,30.25 10.75,28.5 11.75,28.5 v12.25,29
GPIO9  (via drill 0.6)
  Top 0.254: 23.7,37.6 PQ60_HEADER.P$41 23.7,39.05 22.55,40.2 v22.55,40.75 22.55,41.75 22,42.3 15.55,42.3 15.25,42 11.5,42 10,40.5 10,37.25 8.25,35.5 8.25,34.5 10,32.75 10,28.25 10.25,28 18.42,28 MCU.21
  Bottom 0.254: PQ60_RECEPTACLE.P$41 23.7,39.05 22.55,40.2 v22.55,40.75
GPIO10  (via drill 0.6)  (1 unrouted)
  Top 0.254: PQ60_HEADER.P$42 23.1,38.95 21.35,40.7 v21.35,41.3 20.85,41.8 16.05,41.8 15.75,41.5 11.75,41.5 10.5,40.25 10.5,37 9.5,36
  Bottom 0.254: PQ60_RECEPTACLE.P$42 23.1,38.95 21.35,40.7 v21.35,41.3
GPIO11  (via drill 0.6)  (1 unrouted)
  Top 0.254: PQ60_HEADER.P$43 22.5,38.9 20.5,40.9 v18.9,40.9 18.5,41.3 16.25,41.3 15.95,41 12,41 11,40 11,36.75 10,35.75
  Bottom 0.254: PQ60_RECEPTACLE.P$43 22.5,38.9 20.5,40.9 v18.9,40.9
GPIO12  (via drill 0.6)  (2 unrouted)
  Top 0.254: PQ60_HEADER.P$44 21.9,38.85 20.35,40.4 19.65,40.4 19.25,40 18.55,40 18.15,40.4 v16.65,40.4 12.15,40.4 11.5,39.75 11.5,36.5 10.5,35.5 10.5,34.25 11.25,33.5
  Bottom 0.254: PQ60_RECEPTACLE.P$44 21.9,38.85 20.35,40.4 19.65,40.4 19.25,40 18.55,40 18.15,40.4 v16.65,40.4
MISO  (via drill 0.6)  (2 unrouted)
  Top 0.254: PQ60_HEADER.P$32 29.1,38.85 29.35,39.1 30.2,39.1 v31.35,37.95 31.8,37.5 32.5,37.5 33,37 33,36.25 32.25,35.5 31.5,35.5 31,35 31,32.25 32.5,30.75 32.5,29.75 32,29.25 32,28.5 34,28.5 34.75,27.75 34.75,27.54 MCU.11
  Bottom 0.254: PQ60_RECEPTACLE.P$32 29.1,38.85 29.35,39.1 30.2,39.1 v31.35,37.95 | ISP1.1 39.27,14 RF_MODULE.10
MOSI  (via drill 0.6)  (2 unrouted)
  Top 0.254: PQ60_HEADER.P$31 30.43,36.5 | 30.43,36.5 v32,36.5 | 30.43,36.5 30.43,32.08 31.75,30.75 v31.75,30.25 | v33.25,29.5 33.75,29.5 35.25,28 35.25,27.33 MCU.10
  Bottom 0.254: v32,36.5 31.05,36.5 PQ60_RECEPTACLE.P$31 | v31.75,30.25 32.5,29.5 v33.25,29.5 | RF_MODULE.11 36.5,12.5 40.75,12.5 42,11.25 ISP1.4
N$1  (via drill 0.6)
  Top 0.254: MCU.13 28.5,23.58 v28.5,24.75 | v38.25,29.5 38.25,27.75 39.35,26.65 R2.1
  Bottom 0.254: v28.5,24.75 31.5,27.75 33.5,27.75 35,29.25 35,32 35.5,32.5 39.25,32.5 39.25,30.5 v38.25,29.5
N$2
  Top 0.254: MCU.6 34.5,23.75 35.5,23.75 35.5,22.65 C4.1
N$3  (via drill 0.6)  (1 unrouted)
  Top 0.254: MCU.16 25.75,24.21 v25.75,25.75 | v22.75,22.25 19.75,22.25 19,21.5 15.05,21.5 Y2.1
  Bottom 0.254: v25.75,25.75 22.75,22.75 v22.75,22.25
N$4  (via drill 0.6)  (1 unrouted)
  Top 0.254: MCU.17 27.5,21.75 | 27.5,21.75 | 27.5,21.75 25,24.25 v25,24.75 | v21.75,21 20.25,21 19.5,20.25 19.5,20 18.75,19.25 12.75,19.25 12.25,19.75 12.25,21 12.5,21.25 12.5,23.75 16.5,23.75 Y2.3
  Bottom 0.254: v25,24.75 25,23 23,21 v21.75,21
N$5
  Top 0.254: JP1.D+ 31.25,6.25 32,7 32,8.85 R3.1
N$6
  Top 0.254: JP1.D- 30.6,7.75 R1.1
N$7  (1 unrouted)
  Top 0.254: MCU.22 25.75,19.96 25.75,20 20.5,14.75 20.5,6.5
N$8  (2 unrouted)
N$9  (1 unrouted)
N$10  (1 unrouted)
N$11  (2 unrouted)
  Top 0.254: WATCHDOG.4 WATCHDOG.5 WATCHDOG.6
N$12  (1 unrouted)
N$13  (1 unrouted)
N$14
  Bottom 0.254: ANTENNA.P$3 17.77,2 RF_MODULE.1
N$15  (1 unrouted)
N$16  (1 unrouted)
N$17  (1 unrouted)
N$18  (1 unrouted)
N$19  (1 unrouted)
N$20
  Bottom 0.254: LSM9DS0.9 13.39,7.67 C7.1
N$21
  Bottom 0.254: LSM9DS0.8 13.89,9.36 14.5,8.75 14.5,7.81 C7.2
N$22
  Bottom 0.254: R18.2 14.95,25.55 T4.B
N$23
  Bottom 0.254: R19.2 18.45,25.55 T5.B
N$24
  Bottom 0.254: R20.2 21.95,25.55 T6.B
N$26  (1 unrouted)
NIRQ  (1 unrouted)
NSEL  (1 unrouted)
RESET  (via drill 0.6)  (4 unrouted)
  Top 0.254: v28,27.5 27.9,27.6 PQ60_HEADER.P$27 | TC54.1 5.15,30.5 5.5,30.5 6,31 6,32 5.42,32.58 WATCHDOG.7
  Bottom 0.254: PQ60_RECEPTACLE.P$27 27.9,27.6 v28,27.5
RTN_+3V3  (via drill 0.6)
  Top 0.254: PQ60_HEADER.P$55 15.3,39.5 v15.5,39.5 | PQ60_HEADER.P$56 14.7,39.5 v15.5,39.5 | PQ60_HEADER.P$54 PQ60_RECEPTACLE.P$54 15.9,39.4 | 15.9,39.4 15.9,39.5 v15.5,39.5 | 16.5,37 PQ60_HEADER.P$53 16.5,39.5 16,39.5 arc90 15.9,39.4
  Bottom 0.254: PQ60_RECEPTACLE.P$56 14.7,39.5 v15.5,39.5 | v15.5,39.5 15.9,39.5 | PQ60_RECEPTACLE.P$53 16.5,39.5 16,39.5 15.9,39.5 | v15.5,39.5 15.3,39.5 PQ60_RECEPTACLE.P$55 | PQ60_RECEPTACLE.P$54 15.9,39.5
RTN_+3V3_SW1  (via drill 0.6)
  Top 0.254: 14.1,33.65 PQ60_HEADER.P$4 14.1,34 13.93,34.17 13.62,34.17 v13,34.8 13.5,34.3 PQ60_HEADER.P$3
  Bottom 0.254: PQ60_RECEPTACLE.P$4 14.1,34 13.75,34.35 13.45,34.35 | 13.45,34.35 v13,34.8 | PQ60_RECEPTACLE.P$3 13.5,34.3 13.45,34.35
RTN_+3V3_SW2  (via drill 0.6)
  Top 0.254: 16.5,33.75 PQ60_HEADER.P$8 16.5,33.8 v15.5,34.8 15.9,34.4 PQ60_HEADER.P$7
  Bottom 0.254: 16.5,33.75 PQ60_RECEPTACLE.P$8 16.5,33.8 v15.5,34.8 15.9,34.4 PQ60_RECEPTACLE.P$7 15.9,31.25 T4.C
RTN_+3V3_SW3  (via drill 0.6)
  Top 0.254: PQ60_HEADER.P$12 18.9,33.85 18,34.75 v18,34.8 18.3,34.5 PQ60_HEADER.P$11
  Bottom 0.254: PQ60_RECEPTACLE.P$12 18.9,33.85 18.38,34.38 18.38,34.42 v18,34.8 18.3,34.5 PQ60_RECEPTACLE.P$11 18.3,30.15 T5.C
RTN_BATV  (via drill 0.6)
  Top 0.254: PQ60_HEADER.P$47 20.1,39.5 v20,39.5 | PQ60_HEADER.P$48 19.5,39.5 v20,39.5 | PQ60_HEADER.P$45 21.3,38.7 20.7,39.3 | v20,39.5 20.5,39.5 20.7,39.3 | PQ60_HEADER.P$46 20.7,39.3
  Bottom 0.254: PQ60_RECEPTACLE.P$48 19.5,39.5 v20,39.5 | v20,39.5 20.5,39.5 20.75,39.25 | 20.75,39.25 21.3,38.7 PQ60_RECEPTACLE.P$45 | v20,39.5 20.1,39.5 PQ60_RECEPTACLE.P$47 | PQ60_RECEPTACLE.P$46 20.7,39.25 20.75,39.25
RTN_BATV_SW1  (via drill 0.6)
  Top 0.254: PQ60_HEADER.P$16 21.3,34 v20.5,34.8 20.7,34.6 PQ60_HEADER.P$15
  Bottom 0.254: PQ60_RECEPTACLE.P$15 20.7,34.6 v20.5,34.8 21.3,34 PQ60_HEADER.P$16 PQ60_RECEPTACLE.P$16 21.3,29.65 T6.C
RTN_BATV_SW2  (via drill 0.6)
  Top 0.254: PQ60_HEADER.P$19 23.1,34.7 v23,34.8 23.7,34.1 PQ60_HEADER.P$20
  Bottom 0.254: PQ60_RECEPTACLE.P$19 23.1,34.7 v23,34.8 23.7,34.1 PQ60_RECEPTACLE.P$20
RTN_USB_VBUS  (via drill 0.6)
  Top 0.254: PQ60_HEADER.P$24 26.1,34.2 v25.5,34.8 PQ60_HEADER.P$23
  Bottom 0.254: PQ60_RECEPTACLE.P$24 26.1,34.2 v25.5,34.8 PQ60_RECEPTACLE.P$23
SCK  (via drill 0.6)  (2 unrouted)
  Top 0.254: PQ60_HEADER.P$33 28.5,38.9 29.2,39.6 30.4,39.6 31,39 v32.5,39 33.5,38 33.5,35.85 32.6,34.95 31.8,34.95 31.55,34.7 31.55,32.45 35.75,28.25 35.75,27.12 MCU.9
  Bottom 0.254: PQ60_RECEPTACLE.P$33 28.5,38.9 29.2,39.6 30.4,39.6 31,39 v32.5,39
SCL  (via drill 0.6)  (1 unrouted)
  Top 0.254: v29.5,30 29.1,30.4 PQ60_HEADER.P$29 | MCU.18 24.25,24.29 24.25,26.5 25,27.25 v25,27.5
  Bottom 0.254: PQ60_RECEPTACLE.P$29 29.1,30.4 | 29.1,30.4 v29.5,30 | v25,27.5 25,27.75 27.65,30.4 29.1,30.4
SDA  (via drill 0.6)  (1 unrouted)
  Top 0.254: PQ60_HEADER.P$30 29.7,31.3 30.5,30.5 30.5,29.45 v30.65,29.3 | MCU.19 23.75,24.09 v23.75,27.5
  Bottom 0.254: 30.15,30.85 29.7,31.3 PQ60_RECEPTACLE.P$30 | v30.65,29.3 30.5,29.45 30.5,30.5 30.15,30.85 | 30.15,30.85 27.1,30.85 v23.75,27.5
SW1_BAT  (1 unrouted)
SW2_3V3  (1 unrouted)
SW3_3V3  (1 unrouted)
USB_VBUS  (via drill 0.6)
  Top 0.254: PQ60_HEADER.P$21 24.25,32.83 v24.25,35.2 24.25,34.7 24.9,34.05 PQ60_HEADER.P$22
  Bottom 0.254: PQ60_RECEPTACLE.P$22 24.9,34.05 24.25,34.7 v24.25,35.2 24.25,32.2 PQ60_RECEPTACLE.P$21
UVCC  (via drill 0.6)
  Top 0.254: MCU.7 31.5,21.46 31.5,20.5 | 31.5,20.5 31.5,20 v31,19.5 | 31.5,20.5 31.75,20.75 32,20.75 33,19.75 33.33,19.75 MCU.2 | JP1.VBUS 29.95,11.05 v26,15
  Bottom 0.254: v26,15 26.5,15 v31,19.5
VSOL  (2 unrouted)

### Text on the board
tPlace: PocketQube OBC | V. 1.1 | Rev. B